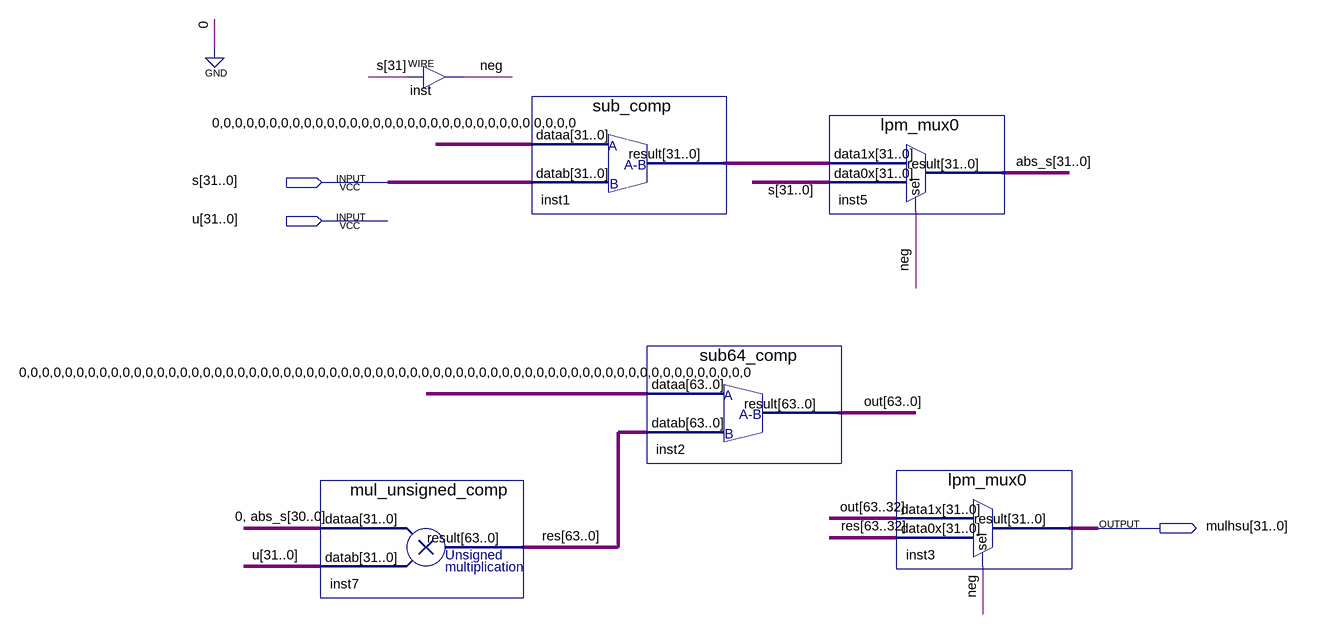
[diagram p0: schematic sheet]
// Quartus schematic mulhsu.bdf as structural Verilog: 6 symbols, 3 pins
module mulhsu (
  input  [31:0] s,
  input  [31:0] u,
  output [31:0] mulhsu
);

  wire neg;
  wire [31:0] abs_s, inst1_result;
  wire [63:0] out, res;

  mul_unsigned_comp inst7 (.dataa({1'b0, abs_s[30:0]}), .datab(u), .result(res));
  assign neg = s[31];  // WIRE inst
  sub_comp inst1 (.dataa({32{1'b0}}), .datab(s), .result(inst1_result));
  sub64_comp inst2 (.dataa({64{1'b0}}), .datab(res), .result(out));
  lpm_mux0 inst5 (.data1x(inst1_result), .data0x(s), .sel(neg), .result(abs_s));
  lpm_mux0 inst3 (.data1x(out[63:32]), .data0x(res[63:32]), .sel(neg), .result(mulhsu));
endmodule
